# EAGLE design IOP_1_0 (EAGLE 8.3.2)
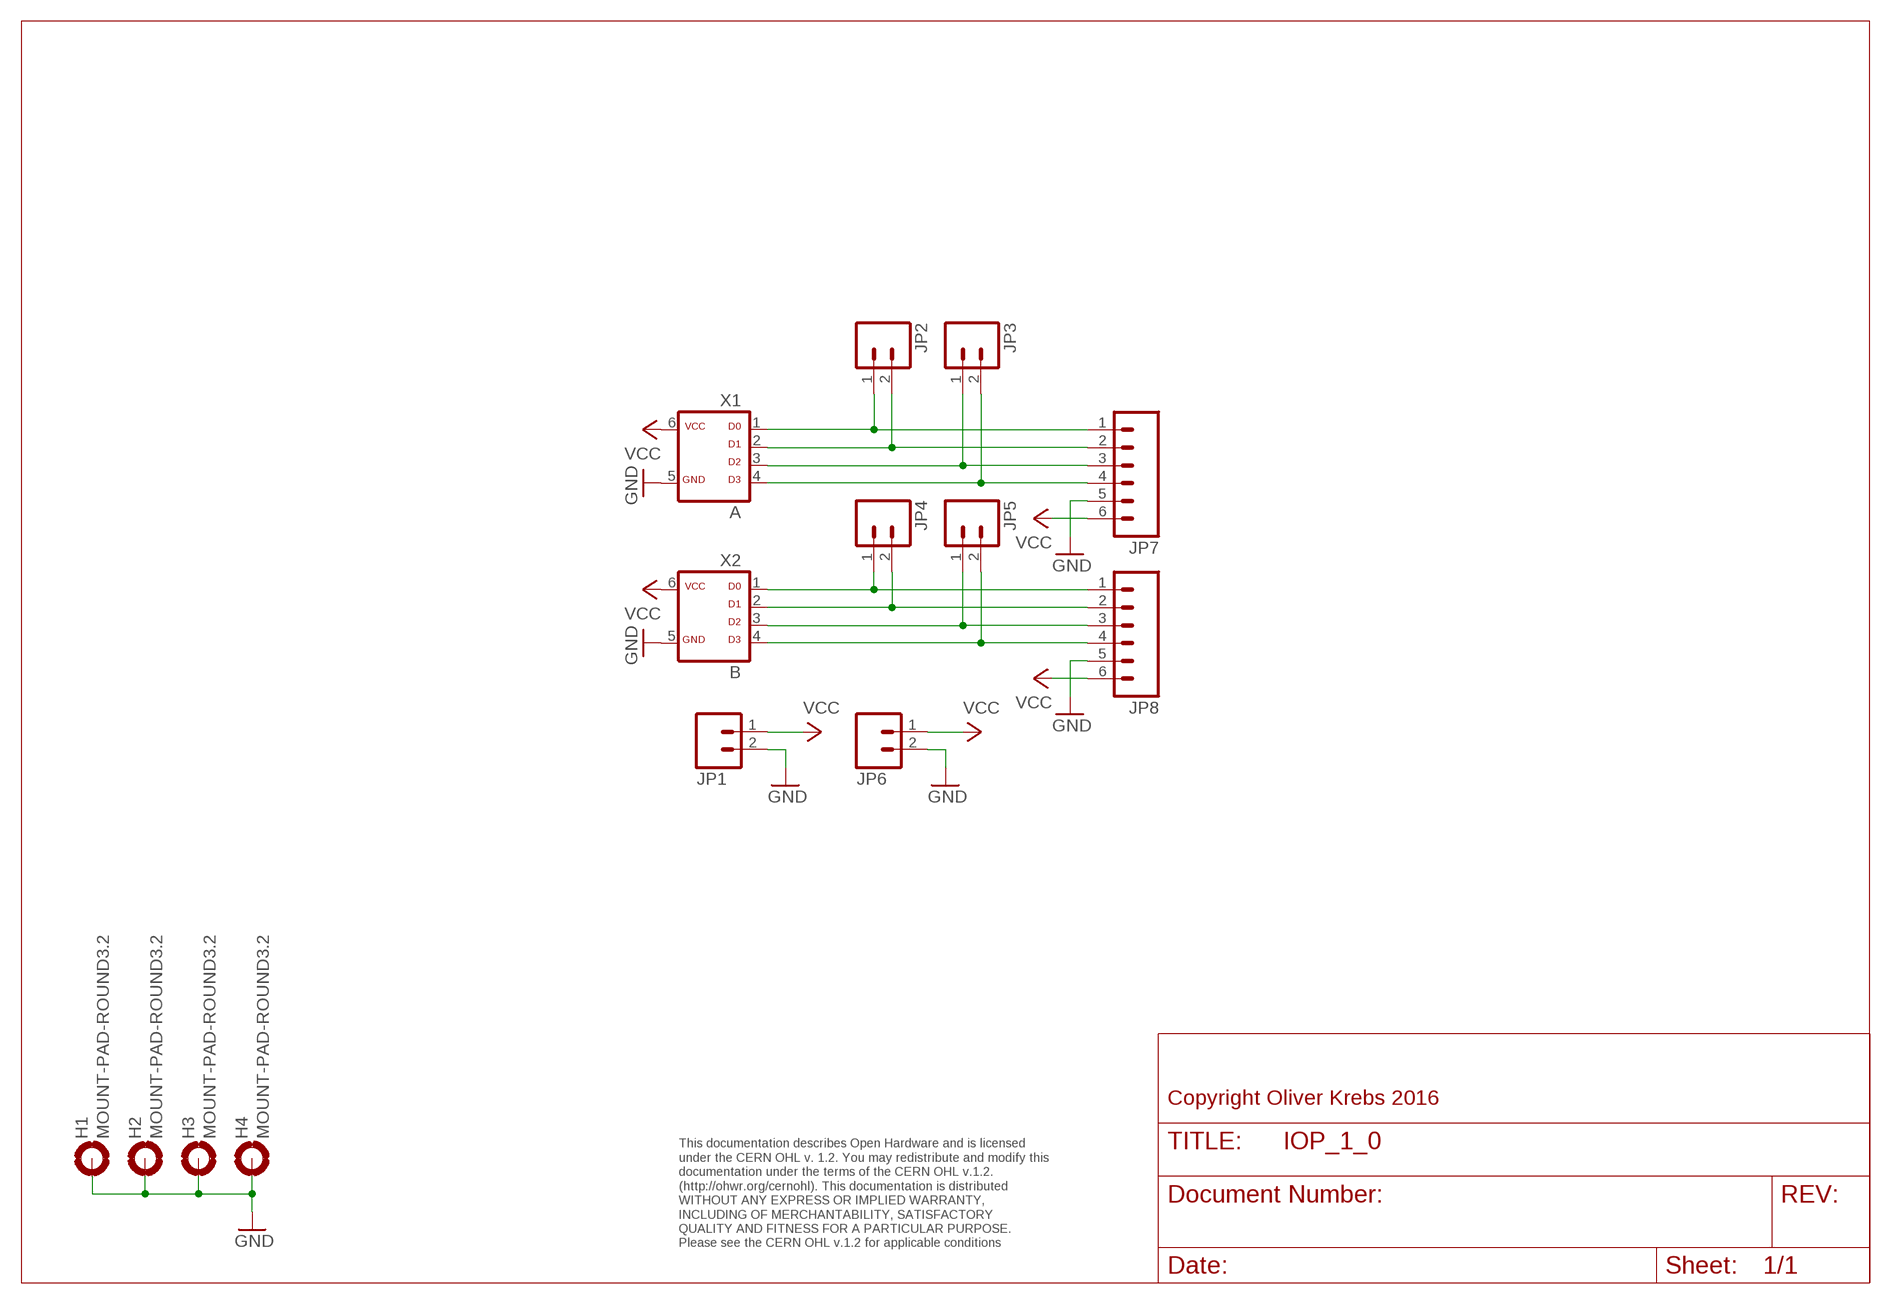
[diagram p0: schematic, sheet 1]

## Parts
H1  MOUNT-PAD-ROUND3.2  [3,2-PAD]
H2  MOUNT-PAD-ROUND3.2  [3,2-PAD]
H3  MOUNT-PAD-ROUND3.2  [3,2-PAD]
H4  MOUNT-PAD-ROUND3.2  [3,2-PAD]
JP1  M021.3MM-5.08  [1X02_BIG_5.08]
JP2  M021.3MM-5.08  [1X02_BIG_5.08]
JP3  M021.3MM-5.08  [1X02_BIG_5.08]
JP4  M021.3MM-5.08  [1X02_BIG_5.08]
JP5  M021.3MM-5.08  [1X02_BIG_5.08]
JP6  M021.3MM-5.08  [1X02_BIG_5.08]
JP7  M06SILK_FEMALE_PTH  [1X06]
JP8  M06SILK_FEMALE_PTH  [1X06]
X1  A  ML6D  [ML-6]
X2  B  ML6D  [ML-6]

## Nets
GND: H1.B3,2(MOUNT) H2.B3,2(MOUNT) H3.B3,2(MOUNT) H4.B3,2(MOUNT) JP1.2 JP6.2 JP7.5 JP8.5 X1.5 X2.5
N$1: JP2.2 JP7.2 X1.2
N$2: JP2.1 JP7.1 X1.1
N$3: JP3.1 JP7.3 X1.3
N$4: JP3.2 JP7.4 X1.4
N$5: JP4.1 JP8.1 X2.1
N$6: JP4.2 JP8.2 X2.2
N$7: JP5.1 JP8.3 X2.3
N$8: JP5.2 JP8.4 X2.4
VCC: JP1.1 JP6.1 JP7.6 JP8.6 X1.6 X2.6

## Notes on the sheet
- Copyright Oliver Krebs 2016
- This documentation describes Open Hardware and is licensed 
  under the CERN OHL v. 1.2. You may redistribute and modify this 
  documentation under the terms of the CERN OHL v.1.2. 
  (http://ohwr.org/cernohl). This documentation is distributed
  WITHOUT ANY EXPRESS OR IMPLIED WARRANTY, 
  INCLUDING OF MERCHANTABILITY, SATISFACTORY 
  QUALITY AND FITNESS FOR A PARTICULAR PURPOSE. 
  Please see the CERN OHL v.1.2 for applicable conditions

## Library data of the parts
H1-H4 = holes:MOUNT-PAD-ROUND: MOUNTING PAD, round
JP1-JP6 = SparkFun-Connectors:M02: Standard 2-pin 0.1" header. Use with - straight break away headers ( PRT-00116) - right angle break away headers (PRT-00553) - swiss pins (PRT-00743) - machine pins (PRT-00117) - female headers (PRT-00115) Molex polarized connector foot print use with: PRT-08233 with associated crimp pins and housings. 2.54_SCREWTERM for use with PRT-10571. 3.5mm Screw Terminal footprints for PRT-08084 5mm Screw Terminal footprints for use with PRT-08432
JP7 JP8 = SparkFun-Connectors:M06: Header 6 Standard 6-pin 0.1" header. Use with straight break away headers (SKU : PRT-00116), right angle break away headers (PRT-00553), swiss pins (PRT-00743), machine pins (PRT-00117), and female headers (PRT-00115). Molex polarized connector foot print use with SKU : PRT-08094 with associated crimp pins and housings. NOTES ON THE VARIANTS LOCK and LOCK_LONGPADS... This footprint was designed to help hold the alignment of a through-hole component (i.e. 6-pin header) while soldering it into place. You may notice that each hole has been shifted either up or down by 0.005 of an inch from it's more standard position (which is a perfectly straight line). This slight alteration caused the pins (the squares in the middle) to touch the edges of the holes. Because they are alternating, it causes a "brace" to hold the component in place. 0.005 has proven to be the perfect amount of "off-center" position when using our standard breakaway headers. Although looks a little odd when you look at the bare footprint, once you have a header in there, the alteration is very hard to notice. Also,if you push a header all the way into place, it is covered up entirely on the bottom side. This idea of altering the position of holes to aid alignment will be further integrated into the Sparkfun Library for other footprints. It can help hold any component with 3 or more connection pins.; PROD_ID: CONN-08437
X1 X2 = 01-my-con:ML6D

## Board
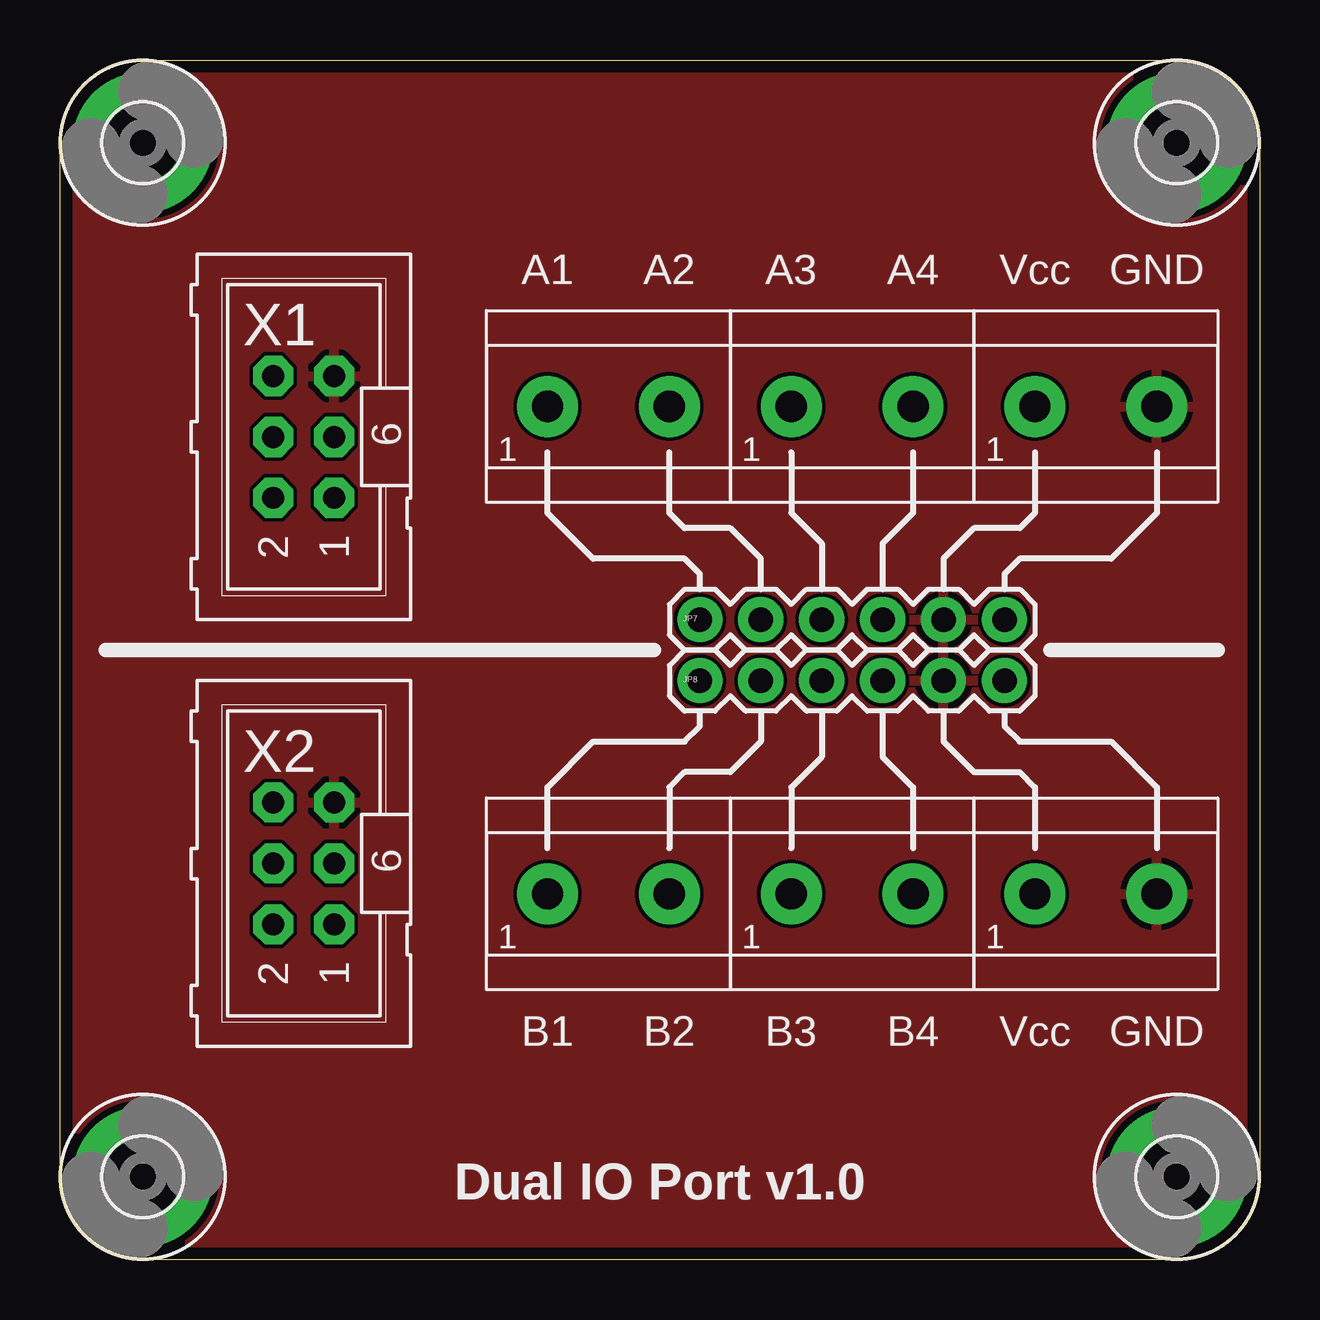
[diagram p1: board, top side]
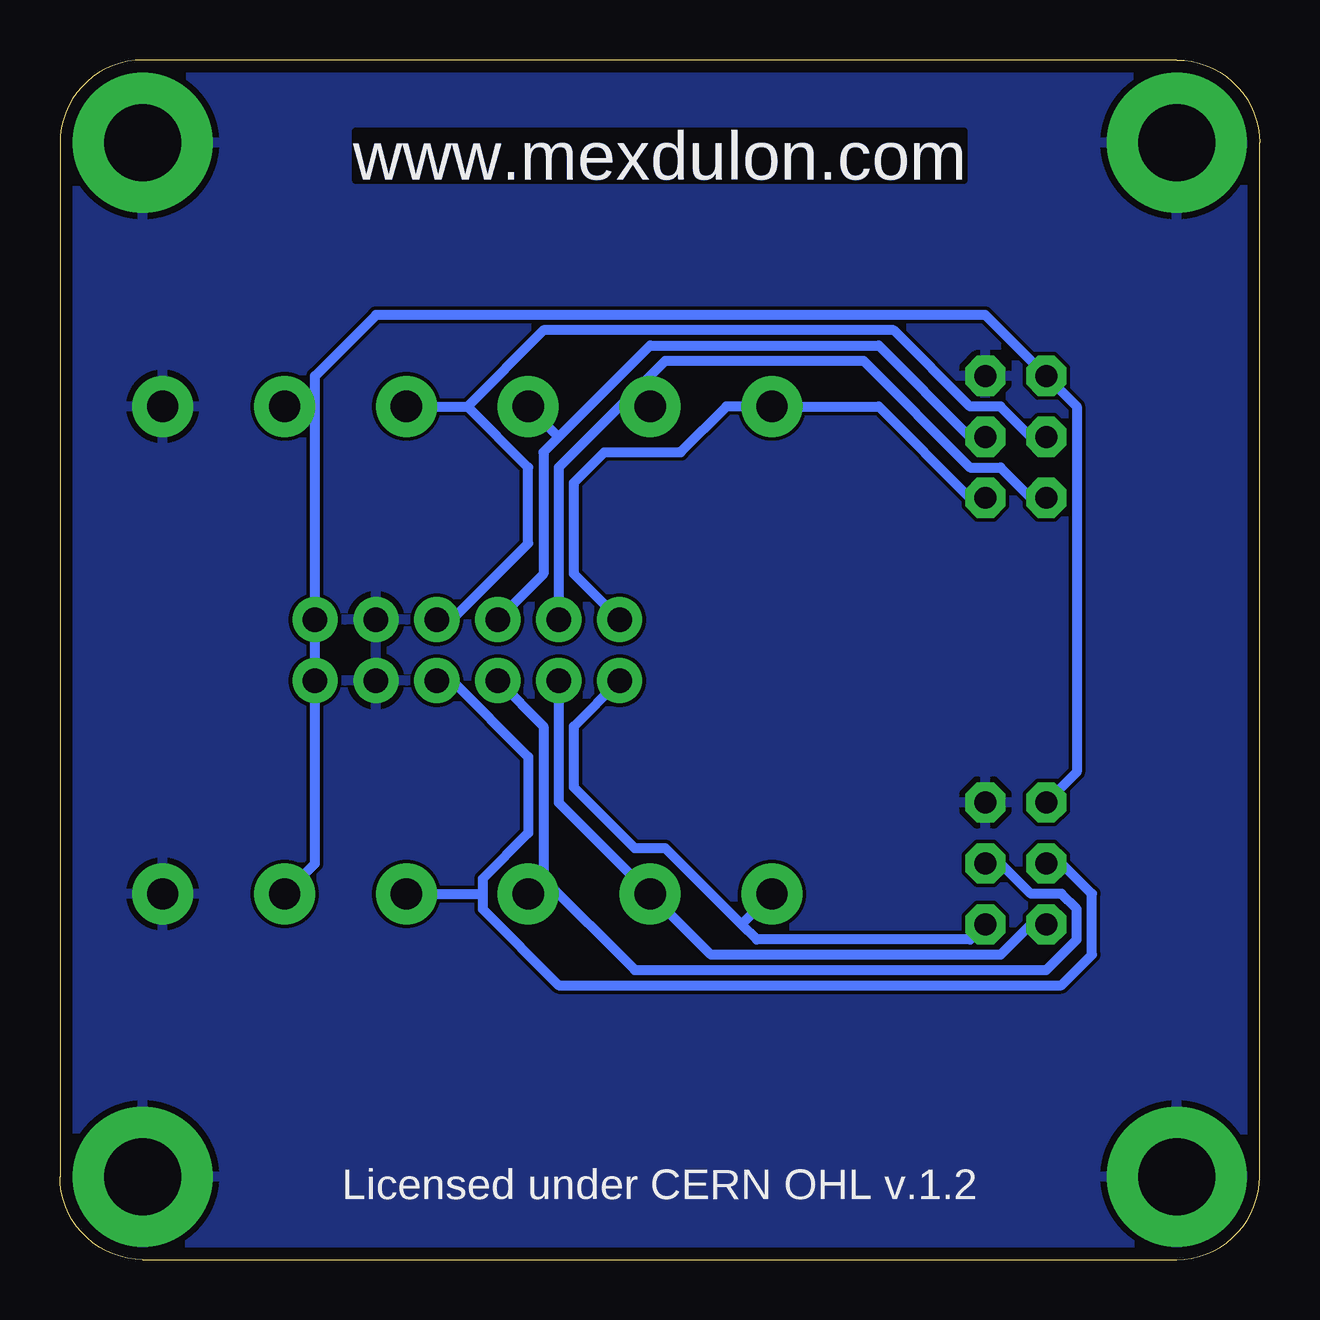
[diagram p2: board, bottom side, seen from below]

Size 50 x 50 mm. Coordinates in mm from the lower left corner, seen from the top.
Outline: 0,3.45 0,46.55 arc-90 3.45,50 46.55,50 arc-90 50,46.55 50,3.45 arc-90 46.55,0 3.45,0 arc-90 0,3.45
Copper layers (1*16): Top 0.035mm / dielectric 1.6mm / Bottom 0.035mm
Design rules "Elecrow_2-layer_PCB_eagle_rule": minimum track width 6mil, minimum drill 12mil, track to track 6mil, track to pad 6mil, pad to pad 6mil, via to via 8mil, smd to smd 0mil, copper to edge 20mil, drill to drill 10mil, minimum pad ring 6mil, minimum via ring 6mil, stop-mask expansion 0mil, vias tented up to drill 100mil, thermal gap 10mil

### Footprints (pad centres in the part's own frame; a part is rotated, then mirrored left to right if it is on the bottom)
3,2-PAD = drill 3.2 pad 5.842: B3,2 0,0
1X02_BIG_5.08 = drill 1.3 pad 2.54: 1 -2.54,0; 2 2.54,0
1X06 = drill 1.016 pad 1.88: 1 0,0; 2 2.54,0; 3 5.08,0; 4 7.62,0; 5 10.16,0; 6 12.7,0
ML-6 = drill 0.914 pad 1.676 octagon: 1 -2.54,-1.27; 2 -2.54,1.27; 3 0,-1.27; 4 0,1.27; 5 2.54,-1.27; 6 2.54,1.27

### Placement (x,y rotation side)
H1  3.45,3.45 0 top
H2  3.45,46.55 0 top
H3  46.55,3.45 0 top
H4  46.55,46.55 0 top
JP1  43.18,15.24 0 top
JP2  22.86,35.56 0 top
JP3  33.02,35.56 0 top
JP4  22.86,15.24 0 top
JP5  33.02,15.24 0 top
JP6  43.18,35.56 0 top
JP7  26.67,26.67 0 top
JP8  26.67,24.13 0 top
X1  10.16,34.29 90 top
X2  10.16,16.51 90 top

### Tracks (layer width: path | path; a pad name or v marks a point on that pad's centre or on a via)
GND
  pour Bottom: 0,0 50.8,0 50.8,50.8 0,50.8
  pour Top: 0,50.16 50.16,50.16 50.16,0 0,0
N$1
  Bottom 0.406: 26.04,36.2 29.21,33.02 JP7.2 | JP2.2 26.04,36.2 | 26.04,36.2 24.77,37.47 16.51,37.47 12.06,33.02 10.79,33.02 9.53,31.75 X1.2
N$2
  Bottom 0.406: X1.1 12.06,31.75 15.88,35.56 JP2.1 22.23,35.56 24.13,33.66 27.3,33.66 28.57,32.38 28.57,28.57 JP7.1
N$3
  Bottom 0.406: 29.21,34.29 29.84,33.66 29.84,28.57 JP7.3 | 29.21,34.29 25.4,38.1 15.88,38.1 12.06,34.29 X1.3 | JP3.1 29.21,34.29
N$4
  Bottom 0.406: X1.4 9.53,34.29 10.79,35.56 12.06,35.56 15.24,38.73 29.84,38.73 33.02,35.56 | JP7.4 33.66,26.67 30.48,29.84 30.48,33.02 33.02,35.56 | JP3.2 33.02,35.56
N$5
  Bottom 0.406: 21.59,13.97 20.95,13.34 12.06,13.34 X2.1 | 21.59,13.97 24.77,17.14 26.04,17.14 28.57,19.68 28.57,22.23 JP8.1 | JP4.1 21.59,13.97
N$6
  Bottom 0.406: JP8.2 29.21,19.05 JP4.2 22.86,12.7 10.79,12.7 9.53,13.97 X2.2
N$7
  Bottom 0.406: X2.3 10.79,16.51 9.53,15.24 8.26,15.24 7.62,14.61 7.62,13.34 8.89,12.06 26.04,12.06 29.84,15.88 | JP8.3 29.84,22.23 29.84,15.88 | 29.84,15.88 JP5.1
N$8
  Bottom 0.406: X2.4 8.26,16.51 6.99,15.24 6.99,12.7 8.26,11.43 29.21,11.43 32.38,14.61 32.38,15.24 | JP8.4 33.66,24.13 30.48,20.95 30.48,17.78 32.38,15.88 32.38,15.24 | JP5.2 32.38,15.24
VCC
  Bottom 0.406: X2.6 7.62,20.32 7.62,35.56 X1.6 11.43,39.37 36.83,39.37 39.37,36.83 39.37,35.56 | JP1.1 39.37,16.51 JP8.6 JP7.6 39.37,35.56 | JP6.1 39.37,35.56

### Text on the board
Bottom: www.mexdulon.com
tNames: A1 | A2 | A3 | A4 | Vcc | GND | B1 | B2 | B3 | B4 | Vcc | GND | Dual IO Port v1.0
bNames: www.mexdulon.com | Licensed under CERN OHL v.1.2